# EAGLE design FT232RL (EAGLE 7.7.0)
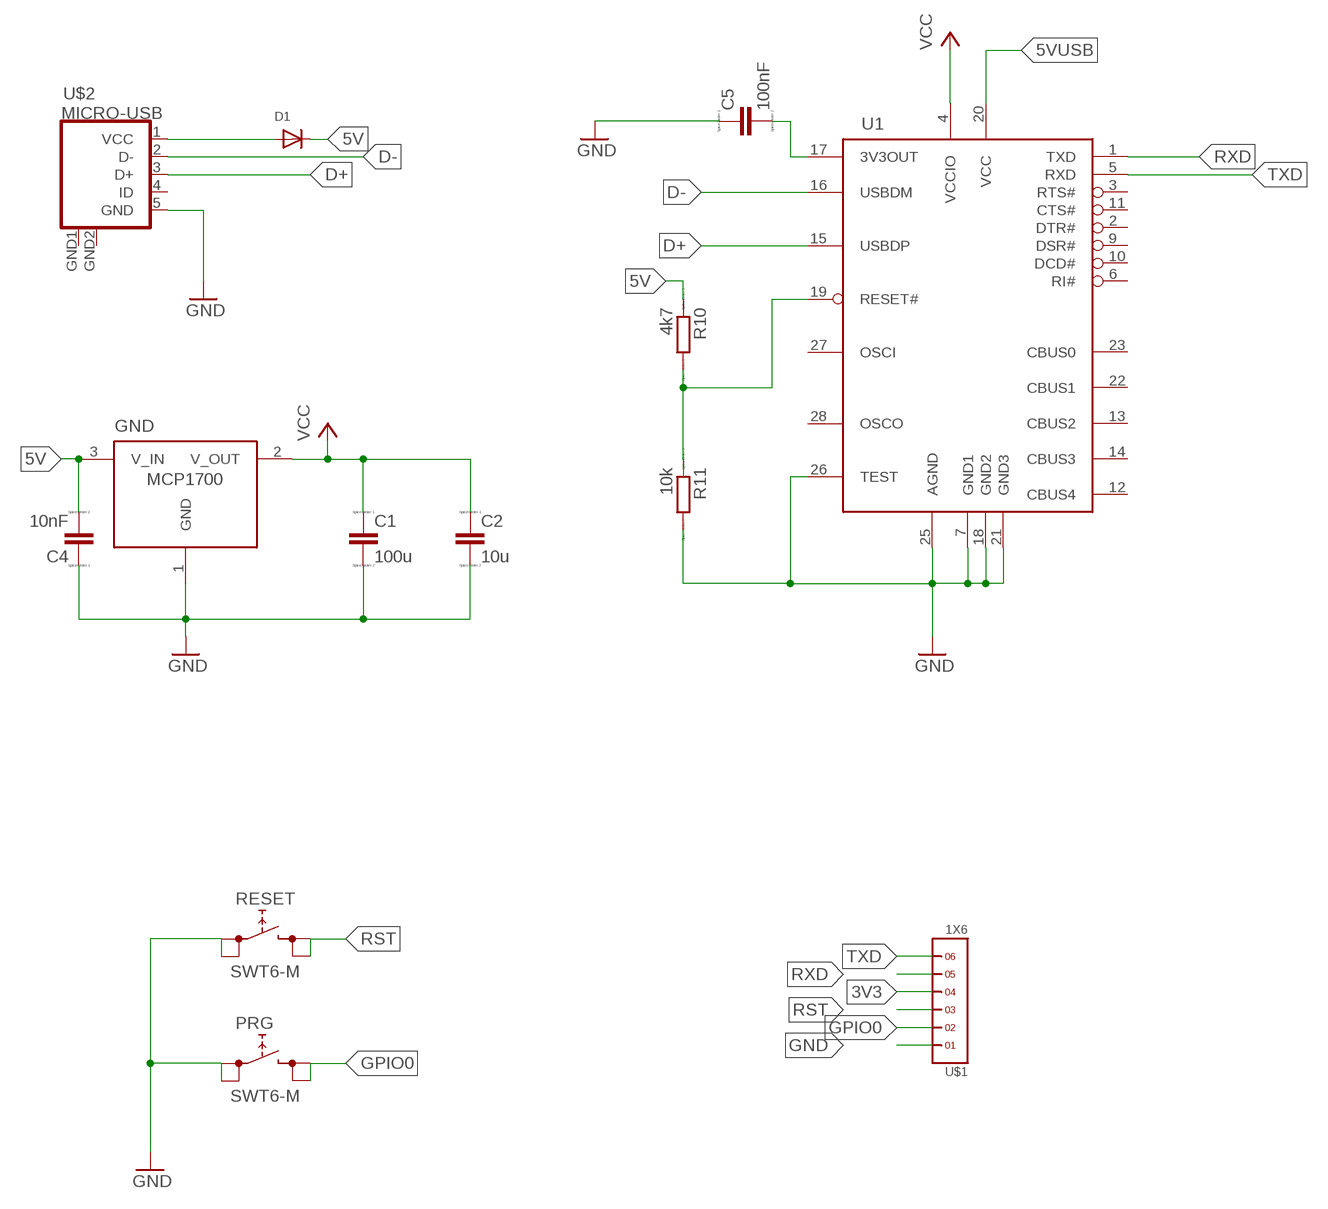
[diagram p0: schematic, sheet 1]

## Parts
C1  100u  C  [C0805]
C2  10u  C  [C0805]
C4  10nF  C  [C0805]
C5  100nF  C  [C0805]
D1  DIODESOD-323F  [SOD-323F]
GND  MCP1700SOT23  [SOT-23]
PRG  SWT6-M  [SWT6-M]
R10  4k7  RR0603  [R0603]
R11  10k  RR0603  [R0603]
RESET  SWT6-M  [SWT6-M]
U1  FT232RL  [SSOP28DB]
U$1  1X6  [1X6]
U$2  MICRO-USB  [MICRO-USB]

## Nets
3V3: C1.1 C2.1 GND.2(V_OUT) U1.4(VCCIO) U$1.4 ; supply symbol labelled VCC
3V3OUT: C5.2 U1.17(3V3OUT)
5V: C4.2 D1.C GND.3(V_IN) R10.1 U1.20(VCC)
5VUSB: D1.A U$2.1(VCC)
D+: U1.15(USBDP) U$2.3(D+)
D-: U1.16(USBDM) U$2.2(D-)
GND: C1.2 C2.2 C4.1 C5.1 GND.1(GND) PRG.1 PRG.2 R11.2 RESET.1 RESET.2 U1.7(GND1) U1.18(GND2) U1.21(GND3) U1.25(AGND) U1.26(TEST) U$1.1 U$2.5(GND)
GPIO0: PRG.3 PRG.4 U$1.2
RESET: R10.2 R11.1 U1.19(RESET#)
RST: RESET.3 RESET.4 U$1.3
RXD: U1.1(TXD) U$1.5
TXD: U1.5(RXD) U$1.6
Unconnected: U1.2(DTR#) U1.3(RTS#) U1.6(RI#) U1.9(DSR#) U1.10(DCD#) U1.11(CTS#) U1.12(CBUS4) U1.13(CBUS2) U1.14(CBUS3) U1.22(CBUS1) U1.23(CBUS0) U1.27(OSCI) U1.28(OSCO) U$2.4(ID)

## Power pins joined to a net without a drawn wire
GND: U$2.GND1(GND) U$2.GND2(GND)

## Library data of the parts
C1 C2 C4 C5 = eagle-ltspice:C: CAPACITOR, European symbol; SPICEMODEL: NONE; SPICEPREFIX: C
D1 = adafruit:DIODE: Diode SMADIODE - SMA Surface Mount Package 20V 1A Schottky Diode Digikey: 641-1014-6-ND DO-1N4148 - Through Hole Small Current Diode SOD-123 20V 1 A (.5mV Vf) Schottky Diode - Digikey: MBRX120TPMSCT-ND SOD-323 10V 570mA (.38mV Vf, 3ns) Schottky Diode - Digikey: ZLLS410CT-ND SOD-523 30V 30mA Schottky Diode (RB751S-40TE61) - Digikey: RB751S-40TE61CT-ND SOT23-R/W - SOT23 Package (R = Solder Paste/Reflow Ovens, W = Hand-Soldering) BAT54Film 40V 300mA - Digikey: 497-7162-1-ND
GND = MCP1700:MCP1700SOT23
PRG RESET = tactile_switch:SWT6-M
R10 R11 = eagle-ltspice:R: RESISTOR, European symbol; SPICEMODEL: NONE; SPICEPREFIX: R
U1 = ftdichip-4:FT232RL: USB UART 4th Generation USB UART (USB <-> Serial) Controller
U$1 = headers(.05in):1X6
U$2 = microusb (1):MICRO-USB: Micro USB B connector

## Board
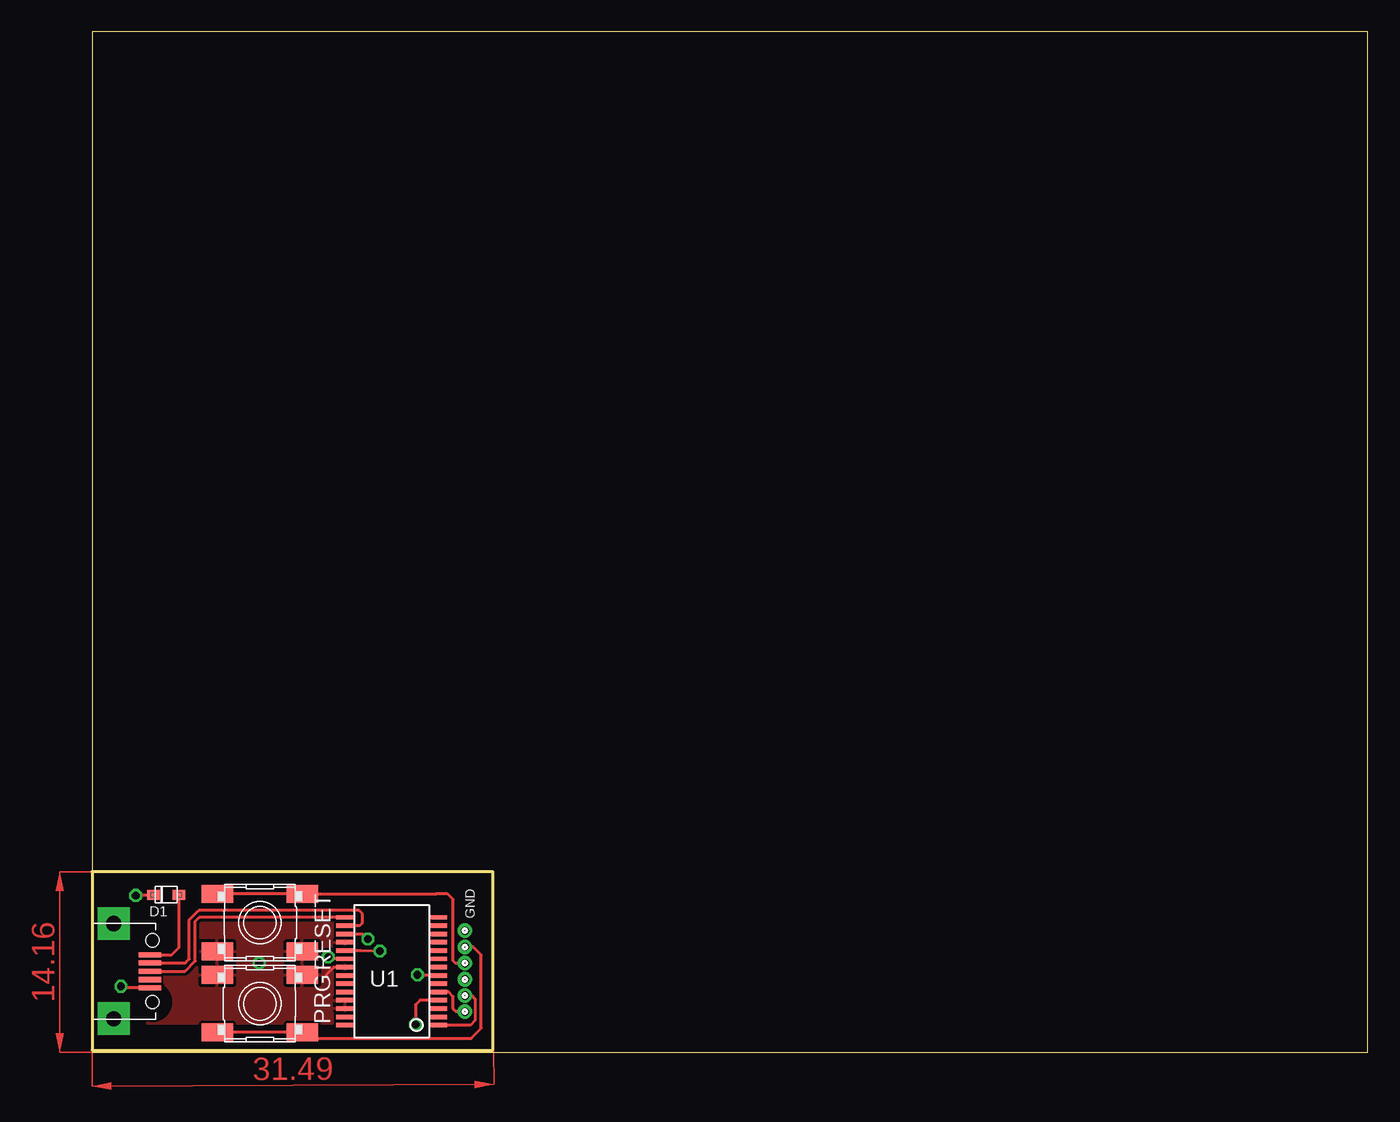
[diagram p1: board, top side]
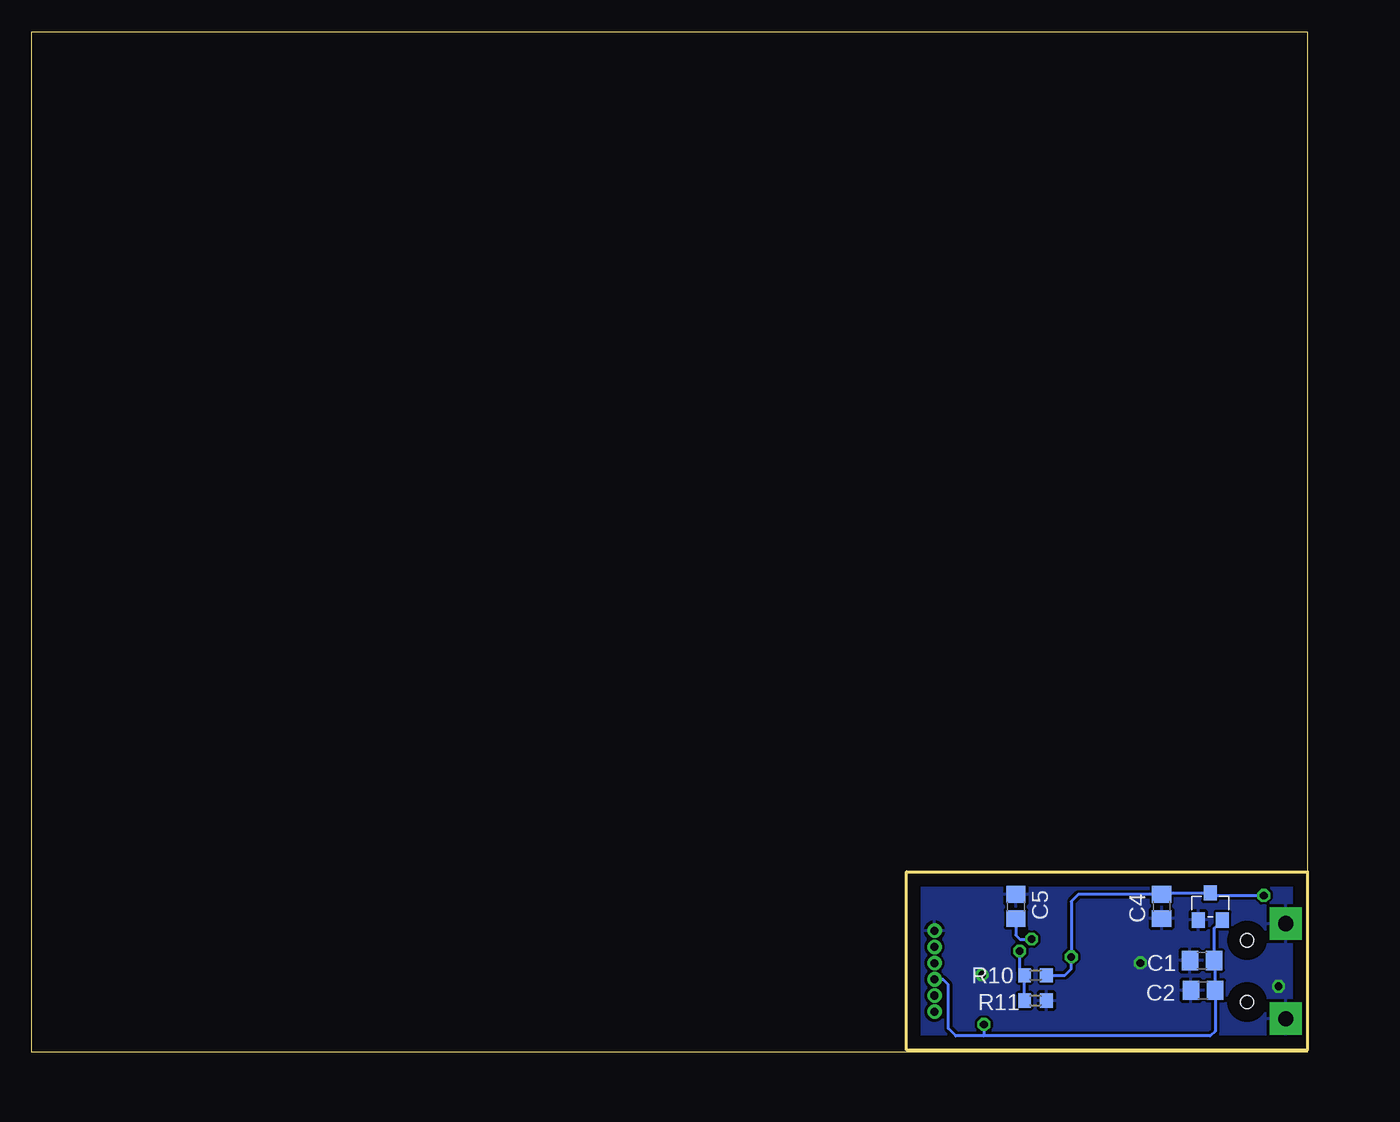
[diagram p2: board, bottom side, seen from below]

Size 100 x 80 mm. Coordinates in mm from the lower left corner, seen from the top.
Outline: 0,14.16 0,80 100,80 100,0 0,0 0,0.16
Outline: 0,14.16 0,0.16
Outline: 0,0.16 31.43,0.16 31.43,14.16 0,14.16
Copper layers (1*16): Top 0.035mm / dielectric 1.5mm / Bottom 0.035mm
Design rules "default": minimum track width 10mil, minimum drill 24mil, track to track 8mil, track to pad 8mil, pad to pad 8mil, via to via 8mil, smd to smd 8mil, copper to edge 40mil, drill to drill 8mil, minimum pad ring 10mil, minimum via ring 8mil, stop-mask expansion 4mil, vias tented up to drill 0mil, thermal gap 10mil

### Footprints (pad centres in the part's own frame; a part is rotated, then mirrored left to right if it is on the bottom)
C0805 = smd 1.3 x 1.5: 1 -0.95,0; 2 0.95,0
SOD-323F = smd 1 x 0.8: A -1,0; C 1,0
SOT-23 = smd 1.016 x 1.2: 1 -0.95,-1.06; 2 0.95,-1.06; 3 0,1.06
SWT6-M = smd 2.489 x 1.397: 1 -3.331,2.25; 2 3.331,2.25; 3 -3.331,-2.25; 4 3.331,-2.25
R0603 = smd 1 x 1.1: 1 -0.85,0; 2 0.85,0
SSOP28DB = smd 0.348 x 1.397: 1 -4.225,-3.656; 2 -3.575,-3.656; 3 -2.925,-3.656; 4 -2.275,-3.656; 5 -1.625,-3.656; 6 -0.975,-3.656; 7 -0.325,-3.656; 8 0.325,-3.656; 9 0.975,-3.656; 10 1.625,-3.656; 11 2.275,-3.656; 12 2.925,-3.656; 13 3.575,-3.656; 14 4.225,-3.656; 15 4.225,3.656; 16 3.575,3.656; 17 2.925,3.656; 18 2.275,3.656; 19 1.625,3.656; 20 0.975,3.656; 21 0.325,3.656; 22 -0.325,3.656; 23 -0.975,3.656; 24 -1.625,3.656; 25 -2.275,3.656; 26 -2.925,3.656; 27 -3.575,3.656; 28 -4.225,3.656
1X6 = drill 0.635 pad 1.016: 1 0,0; 2 1.27,0; 3 2.54,0; 4 3.81,0; 5 5.08,0; 6 6.35,0
MICRO-USB = smd 0.4 x 1.75: 1 -1.3,4.525; 2 -0.65,4.525; 3 0,4.525; 4 0.65,4.525; 5 1.3,4.525 | drill 1.2 pad 2.54 square: GND1 -3.725,1.7; GND2 3.725,1.7 | hole 1.05: -2.425,4.73; 2.425,4.73

### Placement (x,y rotation side)
C1  8.26,7.19 180 bottom
C2  8.18,4.86 180 bottom
C4  11.43,11.43 90 bottom
C5  22.86,11.43 270 bottom
D1  5.81,12.35 180 top
GND  7.62,11.43 0 bottom
PRG  13.15,3.81 0 top
R10  21.32,6.05 180 bottom
R11  21.32,4.05 0 bottom
RESET  13.15,10.16 180 top
U1  23.5,6.35 90 top
U$1  29.24,9.53 270 top
U$2  0,6.35 270 top

### Tracks (layer width: path | path; a pad name or v marks a point on that pad's centre or on a via)
3V3  (via drill 0.6)
  Top 0.254: U1.4 25.7,4.08 25.36,3.73 v25.36,2.18
  Bottom 0.254: GND.2 7.31,9.73 C1.1 7.23,7.19 C2.1 7.23,1.66 7.62,1.27 25.4,1.27 | 25.4,1.27 27.56,1.27 28.16,1.87 28.16,5.29 28.59,5.71 U$1.4 | v25.36,2.18 25.36,1.31 25.4,1.27
3V3OUT  (via drill 0.6)
  Top 0.254: U1.17 21.22,9.28 v21.62,8.87
  Bottom 0.254: C5.2 22.86,9.17 22.56,8.87 v21.62,8.87
5V  (via drill 0.6)
  Top 0.254: D1.C 4.81,12.29 v3.42,12.29 | U1.20 18.66,7.33 v18.51,7.47
  Bottom 0.254: v3.42,12.29 7.62,12.29 GND.3 11.43,12.49 C4.2 17.96,12.38 18.51,11.82 v18.51,7.47 18.51,6.53 19,6.04 R10.1
5VUSB
  Top 0.254: U$2.1 6.25,7.65 6.81,8.21 D1.A
D+
  Top 0.254: U1.15 8.4,10.57 8.09,10.26 8.09,7.16 7.28,6.35 U$2.3
D-
  Top 0.254: U$2.2 7.31,7 7.62,7.31 7.62,10.36 8.37,11.11 20.94,11.11 21.16,10.89 21.16,10.11 20.97,9.93 U1.16
GND  (via drill 0.6)
  Top 0.254: U$2.5 2.37,5.05 v2.26,5.16 | 18.36,6.05 18.35,6.06 18.96,6.67 U1.21 | U1.7 25.56,6.03 v25.51,6.07
  other vias: 13.09,7
  pour Bottom: 0,13.97 31.49,14.13 31.49,0.16 0,0
  pour Top: 4.31,11.43 20.12,11.43 20.12,2.28 4.31,2.28
GPIO0
  Top 0.254: PRG.3 PRG.4 16.64,1.56 17.11,1.09 29.71,1.09 30.5,1.88 30.5,7.62 29.87,8.26 U$1.2
RESET  (via drill 0.6)
  Top 0.254: U1.19 21.12,7.97 v22.56,7.93
  Bottom 0.254: R11.1 R10.2 22.56,6.43 v22.56,7.93
RST
  Top 0.254: RESET.4 RESET.3 26.67,12.41 26.98,12.41 27.88,12.41 28.32,11.98 28.32,7.16 28.49,6.99 U$1.3
RXD
  Top 0.254: U$1.5 29.78,4.45 30.03,4.2 30.03,2.49 29.66,2.12 U1.1
TXD
  Top 0.254: U$1.6 28.56,3.17 28.32,3.42 28.32,4.36 27.95,4.72 U1.5
(copper drawn outside any net)
  shapes: Top area x2

### Text on the board
tNames: GND